# Altium schematic sheet A-01 BLOCK DIAGRAM.SchDoc
size 513 x 386 mm
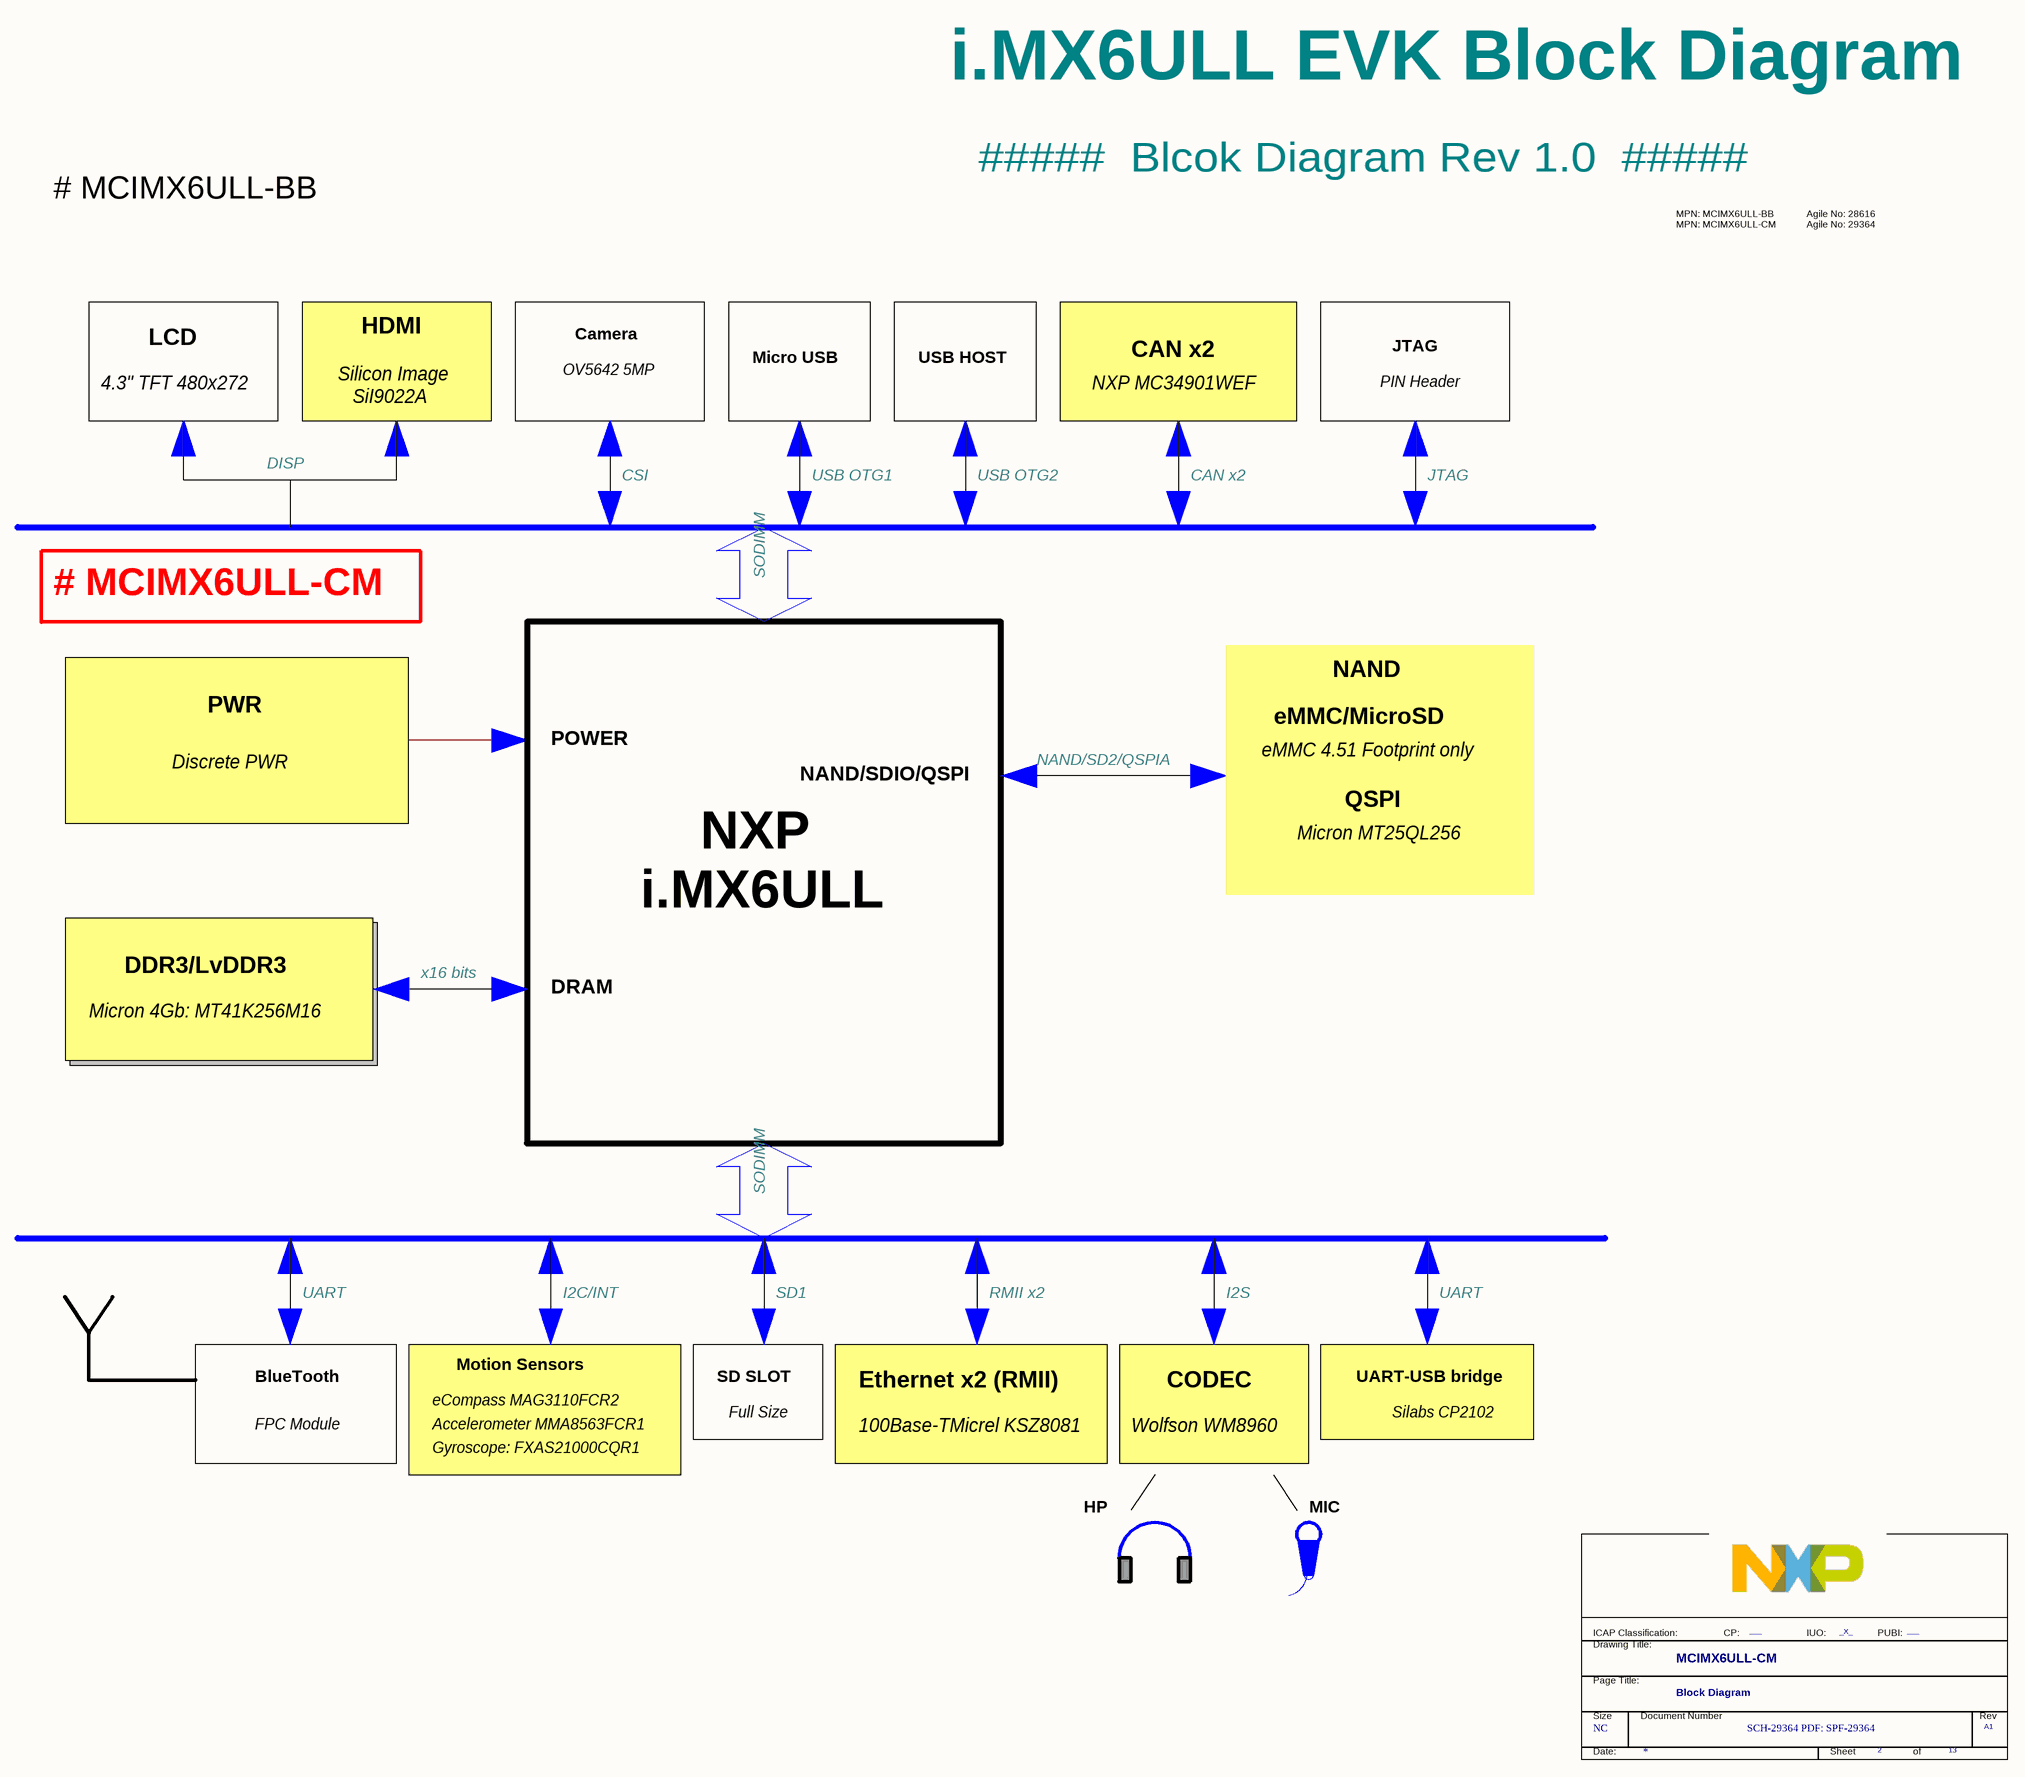
[diagram p0: A-01 BLOCK DIAGRAM.SchDoc]

## Parts
*  PageTitle: Block Diagram  Page Count: 13  Page Number: 2  Page Size: NC  Title: MCIMX6ULL-CM  RevCode: A1  Doc: SCH-29364 PDF: SPF-29364  FCP: ___  FIUO: _X_  (hidden comment: TitleBlock_FS)  (graphical)

## Notes on the sheet
- i.MX6ULL EVK Block Diagram
- #####  Blcok Diagram Rev 1.0  #####
- # MCIMX6ULL-BB
- MPN: MCIMX6ULL-BB
  MPN: MCIMX6ULL-CM
- Agile No: 28616
  Agile No: 29364
- LCD
- Silicon Image
  SiI9022A
- HDMI
- Camera
- Micro USB
- USB HOST
- CAN x2
- JTAG
- 4.3" TFT 480x272
- OV5642 5MP
- NXP MC34901WEF
- PIN Header
- DISP
- CSI
- USB OTG1
- USB OTG2
- # MCIMX6ULL-CM
- SODIMM
- PWR
- eMMC/MicroSD
- NAND
- Discrete PWR
- POWER
- NAND/SDIO/QSPI
- NAND/SD2/QSPIA
- eMMC 4.51 Footprint only
- NXP
  i.MX6ULL
- Micron MT25QL256
- QSPI
- Micron 4Gb: MT41K256M16
- DDR3/LvDDR3
- x16 bits
- DRAM
- UART
- I2C/INT
- SD1
- RMII x2
- I2S
- Motion Sensors
- BlueTooth
- FPC Module
- eCompass MAG3110FCR2
- Accelerometer MMA8563FCR1
- SD SLOT
- Full Size
- Ethernet x2 (RMII)
- 100Base-TMicrel KSZ8081
- Wolfson WM8960
- CODEC
- UART-USB bridge
- Silabs CP2102
- Gyroscope: FXAS21000CQR1
- HP
- MIC
- (in symbol TitleBlock_FS) ICAP Classification:; CP:; IUO:; PUBI:; Drawing Title:; Page Title:; Size; Document Number; Rev; Date:; Sheet; of

## Library data of the parts
* = TitleBlock_FS: OrgName: Freescale Semiconductor; OrgAddr1: 6501 William Cannon Drive West; OrgAddr2: Austin, TX 78735-8598; Page Create Date: March  8, 1995; PUBI: ___; Page Modify Date: *